# Altium schematic sheet signaling.SchDoc
size A4; SheetNumber: 3; SheetTotal: 3
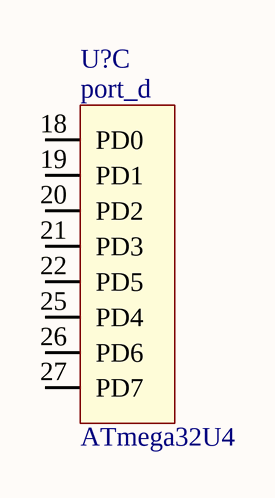
[diagram p0: signaling.SchDoc]

## Parts
U?  ATmega32U4  [QFN44P05P7X7]  (part C of 5)

## Nets

Not connected (* = marked no-connect by the designer): U? 18(PD0) 19(PD1) 20(PD2) 21(PD3) 22(PD5) 25(PD4) 26(PD6) 27(PD7)

## Notes on the sheet
- (in symbol ATmega32U4, part C) port_d